# Altium schematic sheet AT86RF231 - Low Power 2.4 GHz Zigbee 802.15.4 6 LoWPAN Transceiver.SchDoc
size A4
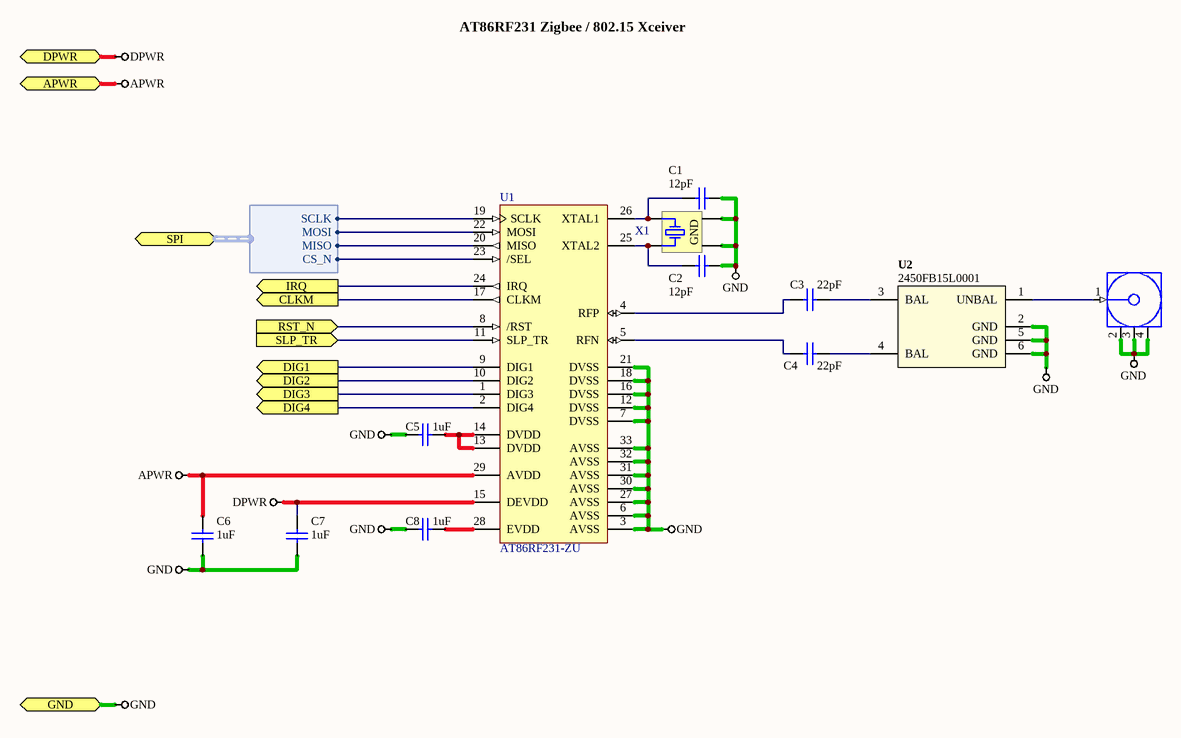
[diagram p0: AT86RF231 - Low Power 2.4 GHz Zigbee 802.15.4 6 LoWPAN Transceiver.SchDoc]

## Parts
C1  value 12pF  [CAPC0402(1005)60_N]  (hidden comment: CAP 12pF 50V 0402(1005))
C2  value 12pF  [CAPC0402(1005)60_N]  (hidden comment: CAP 12pF 50V 0402(1005))
C3  value 22pF  [CAPC0402(1005)60_N]  (hidden comment: CAP 22pF 50V 0402(1005))
C4  value 22pF  [CAPC0402(1005)60_N]  (hidden comment: CAP 22pF 50V 0402(1005))
C5  value 1uF  [CAPC0402(1005)60_N]  (hidden comment: CAP 1uF 16V 0402(1005))
C6  value 1uF  [CAPC0402(1005)60_N]  (hidden comment: CAP 1uF 16V 0402(1005))
C7  value 1uF  [CAPC0402(1005)60_N]  (hidden comment: CAP 1uF 16V 0402(1005))
C8  value 1uF  [CAPC0402(1005)60_N]  (hidden comment: CAP 1uF 16V 0402(1005))
J*  MOLX-73412-0110  [MOLX-73412-0110]  (value not drawn)
U1  AT86RF231-ZU  [32QN2_L]
U2  2450FB15L0001  [JOHT-BALUN200X125X90-6]
X1  S-4025  (value not drawn)

## Ports
APWR, CLKM (out), DIG1 (out), DIG2 (out), DIG3 (out), DIG4 (out), DPWR, GND, IRQ (out), RST_N (in), SLP_TR (in), SPI (harness SPI)

## Harnesses
SPI: SCLK, MISO, MOSI, CS_N

## Nets
APWR: C6.2 U1.29(AVDD) ; port APWR
DPWR: C7.2 U1.15(DEVDD) ; port DPWR
GND: C1.1 C2.1 C5.2 C6.1 C7.1 C8.2 J*.2(GND) J*.3(GND) J*.4(GND) U1.3(AVSS) U1.6(AVSS) U1.7(DVSS) U1.12(DVSS) U1.16(DVSS) U1.18(DVSS) U1.21(DVSS) U1.27(AVSS) U1.30(AVSS) U1.31(AVSS) U1.32(AVSS) U1.33(AVSS) U2.2(GND) U2.5(GND) U2.6(GND) X1.2(GND) X1.4(GND) ; port GND
CLKM: U1.17(CLKM) ; port CLKM
DIG1: U1.9(DIG1) ; port DIG1
DIG2: U1.10(DIG2) ; port DIG2
DIG3: U1.1(DIG3) ; port DIG3
DIG4: U1.2(DIG4) ; port DIG4
IRQ: U1.24(IRQ) ; port IRQ
RST_N: U1.8(/RST) ; port RST_N
SLP_TR: U1.11(SLP_TR) ; port SLP_TR
NetC1_2: C1.2 U1.26(XTAL1) X1.1(X1)
NetC2_2: C2.2 U1.25(XTAL2) X1.3(X2)
NetC3_1: C3.1 U1.4(RFP)
NetC3_2: C3.2 U2.3(BAL)
NetC4_1: C4.1 U1.5(RFN)
NetC4_2: C4.2 U2.4(BAL)
NetC5_1: C5.1 U1.13(DVDD) U1.14(DVDD)
NetC8_1: C8.1 U1.28(EVDD)
NetJ*_1: J*.1(Signal) U2.1(UNBAL)
NetU1_19: U1.19(SCLK) ; port SPI.SCLK
NetU1_20: U1.20(MISO) ; port SPI.MISO
NetU1_22: U1.22(MOSI) ; port SPI.MOSI
NetU1_23: U1.23(/SEL) ; port SPI.CS_N

## Notes on the sheet
- AT86RF231 Zigbee / 802.15 Xceiver

## Library data of the parts
C1 C2 = CMP-1034-00767-1: CAP 12pF 50V ±1% 0402 (1005 Metric) Thickness 0.6mm SMD; Case-EIA: 0402; Case-Metric: 1005; Tolerance: ±1%; Max Thickness: 0.6 mm; Rated Voltage: 50 V; Technology: SMT
C3 C4 = CMP-1034-00914-1: CAP 22pF 50V ±1% 0402 (1005 Metric) Thickness 0.6mm SMD; Case-Metric: 1005; Case-EIA: 0402; Rated Voltage: 50 V; Technology: SMT; Tolerance: ±1%; Max Thickness: 0.6 mm
C5-C8 = CMP-1034-02119-1: CAP 1uF 16V ±10% 0402 (1005 Metric) Thickness 0.6mm SMD; Case-Metric: 1005; Case-EIA: 0402; Tolerance: ±10%; Rated Voltage: 16 V; Max Thickness: 0.6 mm; Technology: SMT
J* = Microcoaxial RF, 50 Ohm, PCB Vertical Jack Receptacle, SMT, 1.25mm Mounted Height: DefaultDesignator: J?; Sub Class: RF; PartNumber: MOLX-73412-0110
U1 = CMP-0107-00028-2: AVR Low Power 2.4 GHz Transceiver for ZigBee IEEE 802.15.4, 6LoWPAN, RF4CE, SP100, WirelessHART and ISM Applications, 32-Pin VQFN (32QN1), Industrial (A) (-40°C to 85°C); ADC Resolution (bits): 0; Antenna Diversity: Yes; Max. Operating Frequency: 0 MHz; Receiver Sensitivity (dBm): -101; Max Data Rate (Mb/s): 2; Power Output (dBm): 3; Crypto Engine: AES; Link Budget (dBm): 104; Receive Current Consumption (mA): 13.2; Transmit Current Consumption (mA): 14.4; Operating Voltage (Vcc): 1.8 to 3.6; Frequency Band: 2.4 GHz; ComponentLink1URL: http://www.atmel.com/; Code_JEDEC: MO-220VHHD-6; DatasheetVersion: rev C, Sep-2009; TWI (I2C): 0; ComponentLink2Description: Datasheet; SRAM (Kbytes): 0; ADC channels: 0; RevisionNote: Updated to Sep-2009 datasheet, symbol revised, parameters added; External PA Control: Yes; SPI: 0; UART: 0; ADC Speed (ksps): 0; PackageVersion: revA, Nov-2007; Timers: 0; PackageDescription: 32-Pin Quad Flat No-Lead (QFN) Sawn,  5 x 5 x 1.0 mm Body, Pitch 0.50 mm, 3.10mm Exposed Pad; PackageReference: 32QN2; EEPROM (Bytes): 0; Analog Comparators: 0; Max I/O Pins: 0; ComponentLink2URL: http://www.atmel.com/Images/doc8111.pdf; ComponentLink1Description: Manufacturer URL
U2 = CMP-5152-00000-1: Filter Balun Atmel 2.45GHZ; Class: Passive; Sub-class: Transformer; Frequency: 2.4 to 2.5 GHz; Unbalanced Impedance: 50 R; IEC-class: Transformer; Datasheet: http://www.johansontechnology.com/images/stories/ip/balun-filters/Balun_Filter_Combo_Matched_2450FB15L0001_v12.pdf
X1 = S-4025: Manufacturer: SIWARD